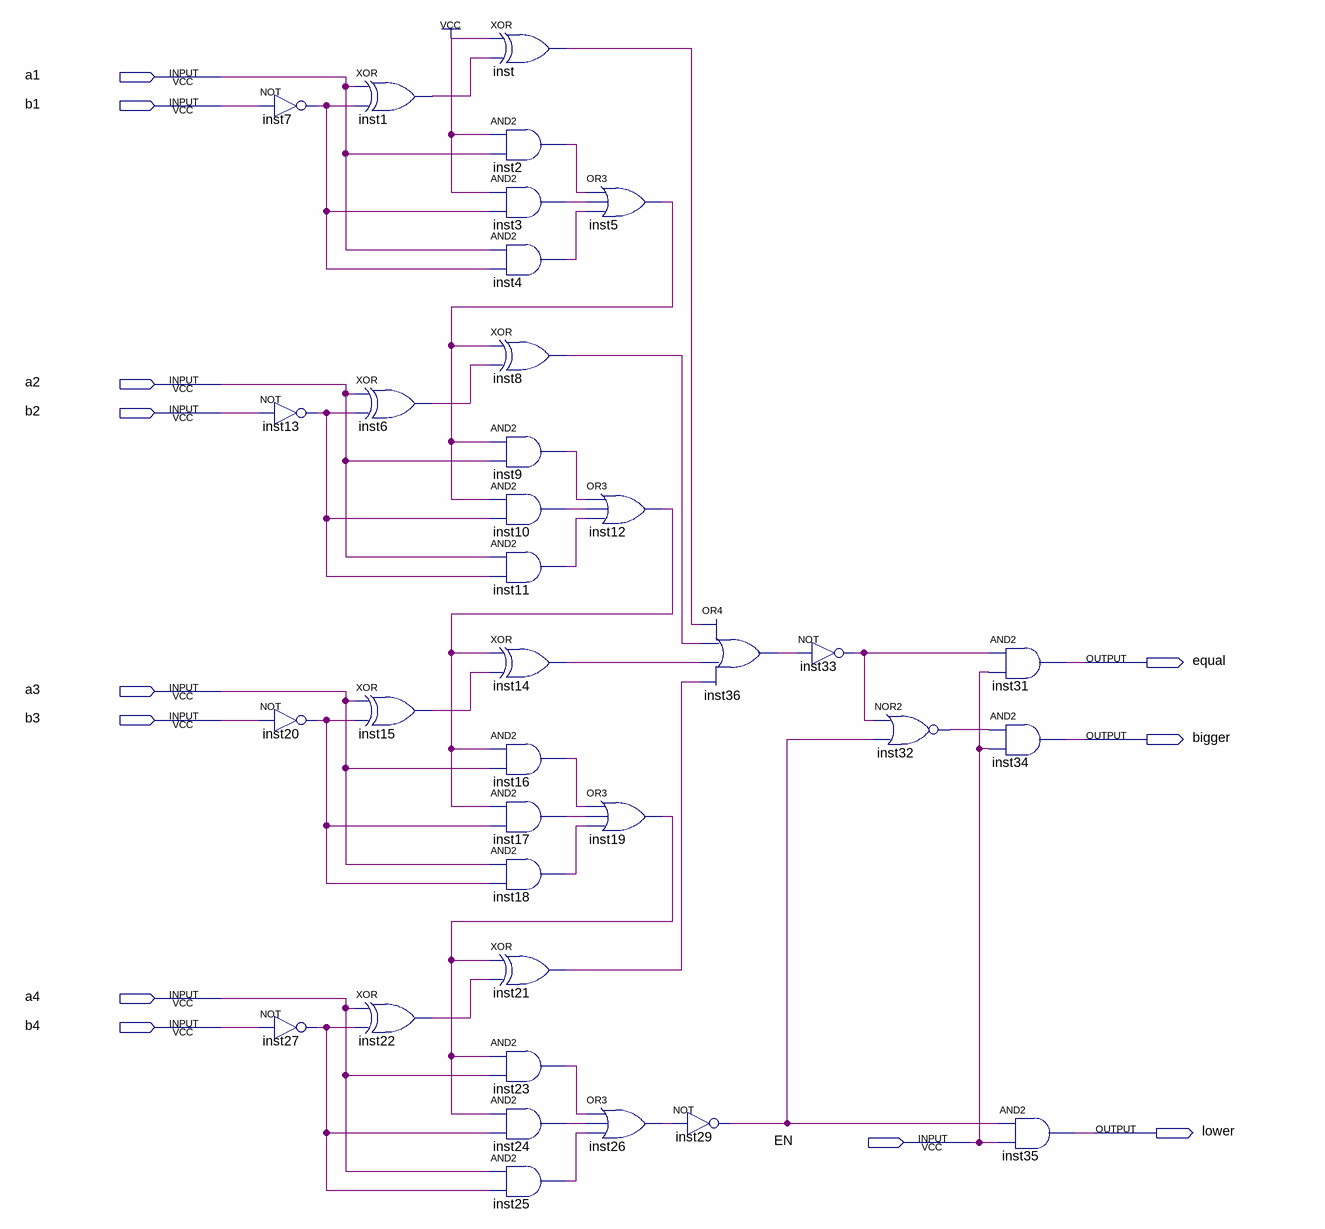
[diagram p0: schematic sheet]
// Quartus schematic Lab1.bdf as structural Verilog: 35 symbols, 12 pins
module Lab1 (
  input  a1,
  input  b1,
  input  a2,
  input  b2,
  input  a3,
  input  b3,
  input  a4,
  input  b4,
  input  EN,
  output equal,
  output bigger,
  output lower
);

  wire inst1_out, inst2_out, inst3_out, inst4_out, inst5_out, inst6_out, inst7_out, inst8_out, inst9_out,
       inst10_out, inst11_out, inst12_out, inst13_out, inst14_out, inst15_out, inst16_out, inst17_out,
       inst18_out, inst19_out, inst20_out, inst21_out, inst22_out, inst23_out, inst24_out, inst25_out,
       inst26_out, inst27_out, inst29_out, inst32_out, inst33_out, inst36_out, inst_out;

  not inst7 (inst7_out, b1);
  not inst13 (inst13_out, b2);
  not inst20 (inst20_out, b3);
  not inst27 (inst27_out, b4);
  xor inst1 (inst1_out, a1, inst7_out);
  xor inst6 (inst6_out, a2, inst13_out);
  xor inst15 (inst15_out, a3, inst20_out);
  xor inst22 (inst22_out, a4, inst27_out);
  xor inst (inst_out, 1'b1, inst1_out);
  and inst2 (inst2_out, 1'b1, a1);
  and inst3 (inst3_out, 1'b1, inst7_out);
  and inst4 (inst4_out, a1, inst7_out);
  xor inst8 (inst8_out, inst5_out, inst6_out);
  and inst9 (inst9_out, inst5_out, a2);
  and inst10 (inst10_out, inst5_out, inst13_out);
  and inst11 (inst11_out, a2, inst13_out);
  xor inst14 (inst14_out, inst12_out, inst15_out);
  and inst16 (inst16_out, inst12_out, a3);
  and inst17 (inst17_out, inst12_out, inst20_out);
  and inst18 (inst18_out, a3, inst20_out);
  xor inst21 (inst21_out, inst19_out, inst22_out);
  and inst23 (inst23_out, inst19_out, a4);
  and inst24 (inst24_out, inst19_out, inst27_out);
  and inst25 (inst25_out, a4, inst27_out);
  or inst5 (inst5_out, inst2_out, inst3_out, inst4_out);
  or inst12 (inst12_out, inst9_out, inst10_out, inst11_out);
  or inst19 (inst19_out, inst16_out, inst17_out, inst18_out);
  or inst26 (inst26_out, inst23_out, inst24_out, inst25_out);
  or inst36 (inst36_out, inst_out, inst8_out, inst14_out, inst21_out);
  not inst29 (inst29_out, inst26_out);
  not inst33 (inst33_out, inst36_out);
  nor inst32 (inst32_out, inst33_out, inst29_out);
  and inst31 (equal, inst33_out, EN);
  and inst34 (bigger, inst32_out, EN);
  and inst35 (lower, inst29_out, EN);
endmodule
